# Altium project ws22_companion-1_0_0.PrjPcb (part 3 of 4)

## Sheet eth_lan8742a_phy.SchDoc
size A; SheetNumber: 8
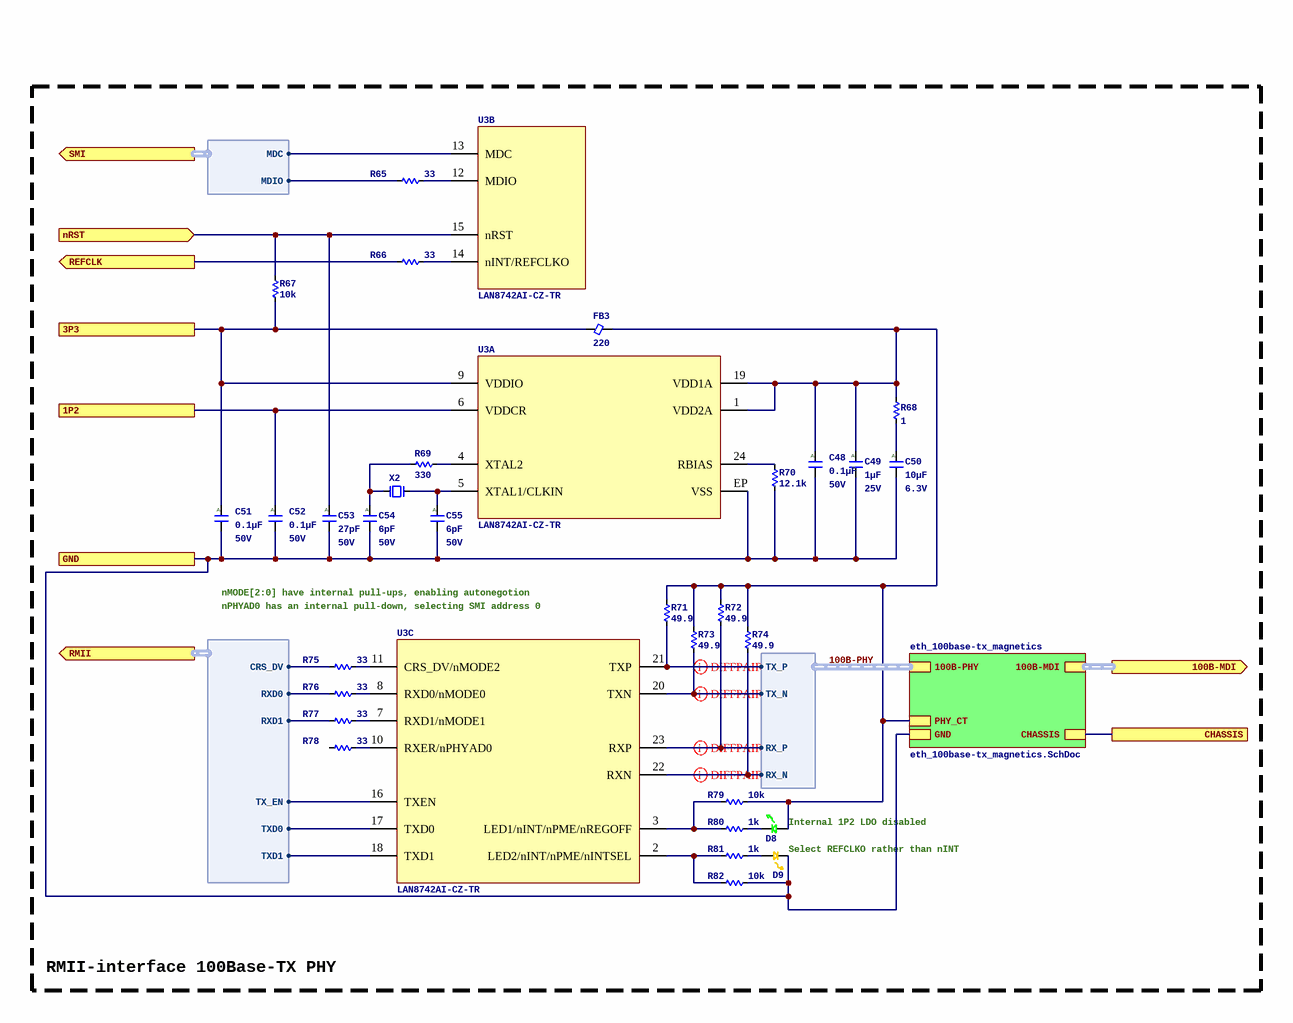
[diagram p9: eth_lan8742a_phy.SchDoc]

### Parts
C48  Capacitance: 0.1µF  Voltage - Rated: 50V  [C0402_0.55MM]  (hidden comment: CGA2B3X7R1H104M050BB)
C49  Capacitance: 1µF  Voltage - Rated: 25V  [C0603_0.80MM]  (hidden comment: CGJ3E1X7R1E105K080AC)
C50  Capacitance: 10µF  Voltage - Rated: 6.3V  [C0805_1.45MM]  (hidden comment: CGA4J1X7R0J106M125AC)
C51  Capacitance: 0.1µF  Voltage - Rated: 50V  [C0402_0.55MM]  (hidden comment: CGA2B3X7R1H104M050BB)
C52  Capacitance: 0.1µF  Voltage - Rated: 50V  [C0402_0.55MM]  (hidden comment: CGA2B3X7R1H104M050BB)
C53  Capacitance: 27pF  Voltage - Rated: 50V  [C0402_0.55MM]  (hidden comment: CGA2B2C0G1H270J050BA)
C54  Capacitance: 6pF  Voltage - Rated: 50V  [C0402_0.55MM]  (hidden comment: CGA2B2C0G1H060D050BA)
C55  Capacitance: 6pF  Voltage - Rated: 50V  [C0402_0.55MM]  (hidden comment: CGA2B2C0G1H060D050BA)
D8  LTST-C190GKT  [LED_0603P_GREEN]  (value not drawn)
D9  LTST-C190AKT  [LED_0603P_AMBER]  (value not drawn)
FB3  Impedance (Ohms @ 100MHz): 220  [FB0402_0.55MM]  (hidden comment: MPZ1005S221ET000)
R65  Resistance: 33  [R0402_0.40MM]  (hidden comment: ERJ-2RKF33R0X)
R66  Resistance: 33  [R0402_0.40MM]  (hidden comment: ERJ-2RKF33R0X)
R67  Resistance: 10k  [R0402_0.40MM]  (hidden comment: ERJ-2RKF1002X)
R68  Resistance: 1  [R0402_0.40MM]  (hidden comment: ERJ-2BQF1R0X)
R69  Resistance: 330  [R0402_0.40MM]  (hidden comment: ERJ-PA2F3300X)
R70  Resistance: 12.1k  [R0402_0.40MM]  (hidden comment: ERJ-2RKF1212X)
R71  Resistance: 49.9  [R0402_0.40MM]  (hidden comment: ERJ-2RKF49R9X)
R72  Resistance: 49.9  [R0402_0.40MM]  (hidden comment: ERJ-2RKF49R9X)
R73  Resistance: 49.9  [R0402_0.40MM]  (hidden comment: ERJ-2RKF49R9X)
R74  Resistance: 49.9  [R0402_0.40MM]  (hidden comment: ERJ-2RKF49R9X)
R75  Resistance: 33  [R0402_0.40MM]  (hidden comment: ERJ-2RKF33R0X)
R76  Resistance: 33  [R0402_0.40MM]  (hidden comment: ERJ-2RKF33R0X)
R77  Resistance: 33  [R0402_0.40MM]  (hidden comment: ERJ-2RKF33R0X)
R78  Resistance: 33  [R0402_0.40MM]  (hidden comment: ERJ-2RKF33R0X)
R79  Resistance: 10k  [R0402_0.40MM]  (hidden comment: ERJ-2RKF1002X)
R80  Resistance: 1k  [R0402_0.40MM]  (hidden comment: ERJ-2RKF1001X)
R81  Resistance: 1k  [R0402_0.40MM]  (hidden comment: ERJ-2RKF1001X)
R82  Resistance: 10k  [R0402_0.40MM]  (hidden comment: ERJ-2RKF1002X)
U3  LAN8742AI-CZ-TR  [24QFN4E]  (parts A,B,C of 3)
X2  XTAL_XRCGB25M000F3A00R0  [4_SMD_2.0X1.6MM]  (value not drawn)

### Sub-sheets
eth_100base-tx_magnetics = eth_100base-tx_magnetics.SchDoc: 100B-PHY (harness 100BASE-TX), GND, CHASSIS, 100B-MDI (harness 100BASE-TX), PHY_CT

### Ports
1P2, 3P3, 100B-MDI (out, harness 100BASE-TX), CHASSIS, GND, nRST (in), REFCLK (out), RMII (out, harness RMII), SMI (out, harness SMI)

### Harnesses
100BASE-TX: RX_N, RX_P, TX_N, TX_P
SMI: MDC, MDIO
RMII: CRS_DV, RXD0, RXD1, TX_EN, TXD0, TXD1

### Nets
1P2: C52.1 U3.6(VDDCR) ; port 1P2
3P3: C51.1 FB3.1 R67.1 U3.9(VDDIO) ; port 3P3
CHASSIS: port CHASSIS, sheet eth_100base-tx_magnetics/CHASSIS
GND: C48.2 C49.2 C50.2 C51.2 C52.2 C53.2 C54.2 C55.2 D9.1 R70.2 R82.2 U3.EP(VSS) ; port GND, sheet eth_100base-tx_magnetics/GND
100B-PHY.RX_N: R74.2 U3.22(RXN) ; sheet eth_100base-tx_magnetics/100B-PHY.RX_N
100B-PHY.RX_P: R72.2 U3.23(RXP) ; sheet eth_100base-tx_magnetics/100B-PHY.RX_P
100B-PHY.TX_N: R73.2 U3.20(TXN) ; sheet eth_100base-tx_magnetics/100B-PHY.TX_N
100B-PHY.TX_P: R71.2 U3.21(TXP) ; sheet eth_100base-tx_magnetics/100B-PHY.TX_P
ETH_PHY_nRST: C53.1 R67.2 U3.15(nRST) ; port nRST
ETH_RMII.CRS_DV: R75.2 ; port RMII.CRS_DV
ETH_RMII.RXD0: R76.2 ; port RMII.RXD0
ETH_RMII.RXD1: R77.2 ; port RMII.RXD1
ETH_RMII.TX_EN: U3.16(TXEN) ; port RMII.TX_EN
ETH_RMII.TXD0: U3.17(TXD0) ; port RMII.TXD0
ETH_RMII.TXD1: U3.18(TXD1) ; port RMII.TXD1
ETH_RMII_REFCLK: R66.2 ; port REFCLK
ETH_SMI.MDC: U3.13(MDC) ; port SMI.MDC
ETH_SMI.MDIO: R65.2 ; port SMI.MDIO
NetC48_1: C48.1 C49.1 D8.2 FB3.2 R68.2 R71.1 R72.1 R73.1 R74.1 R79.2 U3.1(VDD2A) U3.19(VDD1A) ; sheet eth_100base-tx_magnetics/PHY_CT
NetC50_1: C50.1 R68.1
NetC54_1: C54.1 R69.1 X2.3
NetC55_1: C55.1 U3.5(XTAL1/CLKIN) X2.1
NetD8_1: D8.1 R80.1
NetD9_2: D9.2 R81.1
NetR65_1: R65.1 U3.12(MDIO)
NetR66_1: R66.1 U3.14(nINT/REFCLKO)
NetR69_2: R69.2 U3.4(XTAL2)
NetR70_1: R70.1 U3.24(RBIAS)
NetR75_1: R75.1 U3.11(CRS_DV/nMODE2)
NetR76_1: R76.1 U3.8(RXD0/nMODE0)
NetR77_1: R77.1 U3.7(RXD1/nMODE1)
NetR78_1: R78.1 U3.10(RXER/nPHYAD0)
NetR79_1: R79.1 R80.2 U3.3(LED1/nINT/nPME/nREGOFF)
NetR81_2: R81.2 R82.1 U3.2(LED2/nINT/nPME/nINTSEL)

Not connected (* = marked no-connect by the designer): R78 2

### Buses and harness runs
harness 100B-PHY = sheet eth_100base-tx_magnetics/100B-PHY
harness port 100B-MDI = sheet eth_100base-tx_magnetics/100B-MDI

### Layout directives
differential pair; differential pair class DE_100: 100B-PHY.RX_N, 100B-PHY.RX_P, 100B-PHY.TX_N, 100B-PHY.TX_P

### Notes on the sheet
- nMODE[2:0] have internal pull-ups, enabling autonegotion
- nPHYAD0 has an internal pull-down, selecting SMI address 0
- (near D8) Internal 1P2 LDO disabled
- Select REFCLKO rather than nINT
- RMII-interface 100Base-TX PHY
- (in symbol CGA2B2C0G1H060D050BA) A
- (in symbol CGA2B2C0G1H270J050BA) A
- (in symbol CGA2B3X7R1H104M050BB) A
- (in symbol CGA4J1X7R0J106M125AC) A
- (in symbol CGJ3E1X7R1E105K080AC) A

### Library data of the parts
C48 C51 C52 = CGA2B3X7R1H104M050BB: CAP CER 0.1UF 50V X7R 0402; Manufacturer: TDK Corporation; Unit Price (USD): 0.17; Tolerance: ±20%; ComponentLink1URL: https://product.tdk.com/info/en/catalog/datasheets/mlcc_automotive_general_en.pdf?ref_disty=digikey; ComponentLink1Description: Series Datasheet; Series: CGA; Part Status: Active; Temperature Coefficient: X7R; Operating Temperature: -55°C ~ 125°C; Applications: AEC-Q200; Mounting Type: Surface Mount, MLCC; Package / Case: 0402 (1005 Metric); Size / Dimension: 0.039" L x 0.020" W (1.00mm x 0.50mm); Thickness (Max): 0.022" (0.55mm); Supplier 1: Digikey; Supplier Part Number 1: 445-12271-1-ND; Manufacturer Part Number: CGA2B3X7R1H104M050BB
C49 = CGJ3E1X7R1E105K080AC: CAP CER 1UF 25V X7R 0603; Manufacturer: TDK Corporation; Unit Price (USD): 0.55; Tolerance: ±10%; ComponentLink1URL: https://product.tdk.com/info/en/catalog/datasheets/mlcc_highreliability_general_en.pdf?ref_disty=digikey; ComponentLink1Description: Series Datasheet; Series: CGJ; Part Status: Active; Temperature Coefficient: X7R; Operating Temperature: -55°C ~ 125°C; Applications: AEC-Q200; Mounting Type: Surface Mount, MLCC; Package / Case: 0603 (1608 Metric); Size / Dimension: 0.063" L x 0.031" W (1.60mm x 0.80mm); Thickness (Max): 0.031" (0.80mm); Supplier 1: Digikey; Supplier Part Number 1: 445-13311-1-ND; Manufacturer Part Number: CGJ3E1X7R1E105K080AC
C50 = CGA4J1X7R0J106M125AC: CAP CER 10UF 6.3V X7R 0805; Manufacturer: TDK Corporation; Unit Price (USD): 0.43; Tolerance: ±20%; ComponentLink1URL: https://product.tdk.com/info/en/catalog/datasheets/mlcc_automotive_general_en.pdf?ref_disty=digikey; ComponentLink1Description: Series Datasheet; Series: CGA; Part Status: Active; Temperature Coefficient: X7R; Operating Temperature: -55°C ~ 125°C; Applications: AEC-Q200; Mounting Type: Surface Mount, MLCC; Package / Case: 0805 (2012 Metric); Size / Dimension: 0.079" L x 0.049" W (2.00mm x 1.25mm); Thickness (Max): 0.057" (1.45mm); Supplier 1: Digikey; Supplier Part Number 1: 445-12776-1-ND; Manufacturer Part Number: CGA4J1X7R0J106M125AC
C53 = CGA2B2C0G1H270J050BA: CAP CER 27PF 50V C0G 0402; Manufacturer: TDK Corporation; Unit Price (USD): 0.1; Tolerance: ±5%; Temperature Coefficient: C0G, NP0; ComponentLink1URL: https://product.tdk.com/info/en/catalog/datasheets/mlcc_automotive_general_en.pdf?ref_disty=digikey; ComponentLink1Description: Series Datasheet; Supplier 1: Digikey; Supplier Part Number 1: 445-5589-1-ND; Series: CGA; Part Status: Active; Operating Temperature: -55°C ~ 125°C; Applications: AEC-Q200; Mounting Type: Surface Mount, MLCC; Package / Case: 0402 (1005 Metric); Size / Dimension: 0.039" L x 0.020" W (1.00mm x 0.50mm); Thickness (Max): 0.022" (0.55mm); Manufacturer Part Number: CGA2B2C0G1H270J050BA
C54 C55 = CGA2B2C0G1H060D050BA: CAP CER 6PF 50V C0G 0402; Manufacturer: TDK Corporation; Unit Price (USD): 0.1; Tolerance: ±0.5pF; Temperature Coefficient: C0G, NP0; ComponentLink1URL: https://product.tdk.com/info/en/catalog/datasheets/mlcc_automotive_general_en.pdf?ref_disty=digikey; ComponentLink1Description: Series Datasheet; Supplier 1: Digikey; Supplier Part Number 1: 445-5579-1-ND; Series: CGA; Part Status: Active; Operating Temperature: -55°C ~ 125°C; Applications: AEC-Q200; Mounting Type: Surface Mount, MLCC; Package / Case: 0402 (1005 Metric); Size / Dimension: 0.039" L x 0.020" W (1.00mm x 0.50mm); Thickness (Max): 0.022" (0.55mm); Manufacturer Part Number: CGA2B2C0G1H060D050BA
D8 = LED_0603_GREEN_LTST-C190GKT: LED GREEN CLEAR 0603 SMD; Manufacturer: Lite-On Inc; Supplier 1: Digikey; ComponentLink1URL: https://mm.digikey.com/Volume0/opasdata/d220001/medias/docus/858/LTST-C190GKT.pdf; ComponentLink1Description: Datasheet; Supplier Part Number 1: 160-1183-1-ND; Manufacturer Part Number: LTST-C190GKT; Supplier 2: LCSC; Supplier Part Number 2: C125093
D9 = LED_0603_AMBER_LTST-C190AKT: LED AMBER CLEAR 0603 SMD; Manufacturer: Lite-On Inc; Supplier 1: Digikey; ComponentLink1URL: https://mm.digikey.com/Volume0/opasdata/d220001/medias/docus/1139/LTST-C190AKT.pdf; ComponentLink1Description: Datasheet; Supplier Part Number 1: 160-1180-1-ND; Manufacturer Part Number: LTST-C190AKT; Supplier 2: LCSC; Supplier Part Number 2: C6085129
FB3 = MPZ1005S221ET000: FERRITE BEAD 220 OHM 0402 1LN; Manufacturer: TDK Corporation; Filter Type: Power Line; Current Rating (Max): 900mA; DC Resistance (DCR) (Max): 220mOhm; ComponentLink1URL: https://product.tdk.com/info/en/catalog/datasheets/beads_commercial_power_mpz1005-e_en.pdf?ref_disty=digikey; ComponentLink1Description: Datasheet; Series: MPZ-E; Part Status: Active; Operating Temperature: -55°C ~ 125°C; Package / Case: 0402 (1005 Metric); Mounting Type: Surface Mount; Height (Max): 0.022" (0.55mm); Size / Dimension: 0.039" L x 0.020" W (1.00mm x 0.50mm); Supplier Part Number 1: 445-9329-1-ND; Supplier 1: Digikey; Manufacturer Part Number: MPZ1005S221ET000
R65 R66 R75-R78 = ERJ-2RKF33R0X: RES SMD 33 OHM 1% 1/10W 0402; Manufacturer: Panasonic Electronic Components; Unit Price (USD): 0.1; Power (Watts): 0.1W, 1/10W; Temperature Coefficient: ±100ppm/°C; ComponentLink1Description: Datasheet; ComponentLink1URL: https://industrial.panasonic.com/cdbs/www-data/pdf/RDA0000/AOA0000C304.pdf; Series: ERJ; Tolerance: ±1%; Composition: Thick Film; Features: Automotive AEC-Q200; Operating Temperature: -55°C ~ 155°C; Package / Case: 0402 (1005 Metric); Supplier Device Package: 0402; Size / Dimension: 0.039" L x 0.020" W (1.00mm x 0.50mm); Height - Seated (Max): 0.016" (0.40mm); Supplier 1: Digikey; Supplier Part Number 1: P33.0LCT-ND; Manufacturer Part Number: ERJ-2RKF33R0X
R67 R79 R82 = ERJ-2RKF1002X: RES SMD 10K OHM 1% 1/10W 0402; Manufacturer: Panasonic Electronic Components; Unit Price (USD): 0.1; Power (Watts): 0.1W, 1/10W; Temperature Coefficient: ±100ppm/°C; ComponentLink1Description: Datasheet; ComponentLink1URL: https://industrial.panasonic.com/cdbs/www-data/pdf/RDA0000/AOA0000C304.pdf; Series: ERJ; Tolerance: ±1%; Composition: Thick Film; Features: Automotive AEC-Q200; Operating Temperature: -55°C ~ 155°C; Package / Case: 0402 (1005 Metric); Supplier Device Package: 0402; Size / Dimension: 0.039" L x 0.020" W (1.00mm x 0.50mm); Height - Seated (Max): 0.016" (0.40mm); Supplier 1: Digikey; Supplier Part Number 1: P10.0KLCT-ND; Manufacturer Part Number: ERJ-2RKF1002X
R68 = ERJ-2BQF1R0X: RES SMD 1 OHM 1% 1/6W 0402; Manufacturer: Panasonic Electronic Components; Unit Price (USD): 0.41; Power (Watts): 0.167W, 1/6W; Temperature Coefficient: ±250ppm/°C; ComponentLink1Description: Datasheet; ComponentLink1URL: https://industrial.panasonic.com/cdbs/www-data/pdf/RDN0000/AOA0000C313.pdf; Series: ERJ; Tolerance: ±1%; Composition: Thick Film; Features: Automotive AEC-Q200, Current Sense; Operating Temperature: -55°C ~ 125°C; Package / Case: 0402 (1005 Metric); Supplier Device Package: 0402; Size / Dimension: 0.039" L x 0.020" W (1.00mm x 0.50mm); Height - Seated (Max): 0.016" (0.40mm); Supplier 1: Digikey; Supplier Part Number 1: P17252CT-ND; Manufacturer Part Number: ERJ-2BQF1R0X
R69 = ERJ-PA2F3300X: RES SMD 330 OHM 1% 1/5W 0402; Manufacturer: Panasonic Electronic Components; Unit Price (USD): 0.21; Power (Watts): 0.2W, 1/5W; Temperature Coefficient: ±100ppm/°C; ComponentLink1Description: Datasheet; ComponentLink1URL: https://industrial.panasonic.com/cdbs/www-data/pdf/RDO0000/AOA0000C331.pdf; Series: ERJ; Tolerance: ±1%; Composition: Thick Film; Features: Automotive AEC-Q200, Pulse Withstanding; Operating Temperature: -55°C ~ 155°C; Package / Case: 0402 (1005 Metric); Supplier Device Package: 0402; Size / Dimension: 0.039" L x 0.020" W (1.00mm x 0.50mm); Height - Seated (Max): 0.016" (0.40mm); Supplier 1: Digikey; Supplier Part Number 1: P17221CT-ND; Manufacturer Part Number: ERJ-PA2F3300X
R70 = ERJ-2RKF1212X: RES SMD 12.1K OHM 1% 1/10W 0402; Manufacturer: Panasonic Electronic Components; Unit Price (USD): 0.1; Power (Watts): 0.1W, 1/10W; Temperature Coefficient: ±100ppm/°C; ComponentLink1Description: Datasheet; ComponentLink1URL: https://industrial.panasonic.com/cdbs/www-data/pdf/RDA0000/AOA0000C304.pdf; Series: ERJ; Tolerance: ±1%; Composition: Thick Film; Features: Automotive AEC-Q200; Operating Temperature: -55°C ~ 155°C; Package / Case: 0402 (1005 Metric); Supplier Device Package: 0402; Size / Dimension: 0.039" L x 0.020" W (1.00mm x 0.50mm); Height - Seated (Max): 0.016" (0.40mm); Supplier 1: Digikey; Supplier Part Number 1: P12.1KLCT-ND; Manufacturer Part Number: ERJ-2RKF1212X
R71-R74 = ERJ-2RKF49R9X: RES SMD 49.9 OHM 1% 1/10W 0402; Manufacturer: Panasonic Electronic Components; Unit Price (USD): 0.1; Power (Watts): 0.1W, 1/10W; Temperature Coefficient: ±100ppm/°C; ComponentLink1Description: Datasheet; ComponentLink1URL: https://industrial.panasonic.com/cdbs/www-data/pdf/RDA0000/AOA0000C304.pdf; Series: ERJ; Tolerance: ±1%; Composition: Thick Film; Features: Automotive AEC-Q200; Operating Temperature: -55°C ~ 155°C; Package / Case: 0402 (1005 Metric); Supplier Device Package: 0402; Size / Dimension: 0.039" L x 0.020" W (1.00mm x 0.50mm); Height - Seated (Max): 0.016" (0.40mm); Supplier 1: Digikey; Supplier Part Number 1: P49.9LCT-ND; Manufacturer Part Number: ERJ-2RKF49R9X
R80 R81 = ERJ-2RKF1001X: RES SMD 1K OHM 1% 1/10W 0402; Manufacturer: Panasonic Electronic Components; Unit Price (USD): 0.1; Power (Watts): 0.1W, 1/10W; Temperature Coefficient: ±100ppm/°C; ComponentLink1Description: Datasheet; ComponentLink1URL: https://industrial.panasonic.com/cdbs/www-data/pdf/RDA0000/AOA0000C304.pdf; Series: ERJ; Tolerance: ±1%; Composition: Thick Film; Features: Automotive AEC-Q200; Operating Temperature: -55°C ~ 155°C; Package / Case: 0402 (1005 Metric); Supplier Device Package: 0402; Size / Dimension: 0.039" L x 0.020" W (1.00mm x 0.50mm); Height - Seated (Max): 0.016" (0.40mm); Supplier 1: Digikey; Supplier Part Number 1: P1.00KLCT-ND; Manufacturer Part Number: ERJ-2RKF1001X
U3 = ETH_PHY_LAN8742AI: Ethernet Transceiver, PQCC24; Manufacturer: Microchip; Supplier 1: Digikey; Supplier Part Number 1: LAN8742AI-CZ-CT-ND; Manufacturer Part Number: LAN8742AI-CZ-TR; ComponentLink1URL: https://ww1.microchip.com/downloads/aemDocuments/documents/OTH/ProductDocuments/DataSheets/8742a.pdf; ComponentLink1Description: Datasheet; Supplier 2: LCSC; Supplier Part Number 2: C153279
X2 = XTAL_XRCGB25M000F3A00R0: CRYSTAL 25.000MHZ 6PF SMD; Manufacturer: Murata; Supplier 1: Digikey; Supplier Part Number 1: 490-12146-2-ND; Manufacturer Part Number: XRCGB25M000F3A00R0; ComponentLink1Description: Datasheet; ComponentLink1URL: https://www.murata.com/products/productdata/8801076543518/SPEC-XRCGB25M000F3A00R0.pdf; Supplier 2: LCSC; Supplier Part Number 2: C467842

## Sheet eth_100base-tx_magnetics.SchDoc
size A; SheetNumber: 9
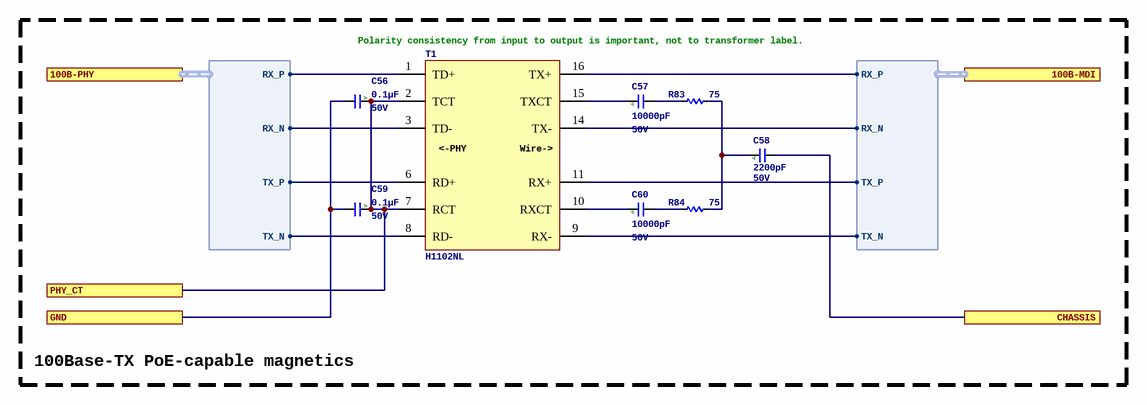
[diagram p10: eth_100base-tx_magnetics.SchDoc]

### Parts
C56  Capacitance: 0.1µF  Voltage - Rated: 50V  [C0402_0.55MM]  (hidden comment: CGA2B3X7R1H104M050BB)
C57  Capacitance: 10000pF  Voltage - Rated: 50V  [C0402_0.50MM]  (hidden comment: CGJ2B3X7R1H103K050BB)
C58  Capacitance: 2200pF  Voltage - Rated: 50V  [C0402_0.55MM]  (hidden comment: CGA2B2X7R1H222M050BA)
C59  Capacitance: 0.1µF  Voltage - Rated: 50V  [C0402_0.55MM]  (hidden comment: CGA2B3X7R1H104M050BB)
C60  Capacitance: 10000pF  Voltage - Rated: 50V  [C0402_0.50MM]  (hidden comment: CGJ2B3X7R1H103K050BB)
R83  Resistance: 75  [R0402_0.40MM]  (hidden comment: ERJ-2RKF75R0X)
R84  Resistance: 75  [R0402_0.40MM]  (hidden comment: ERJ-2RKF75R0X)
T1  H1102NL  [EPCOS_LAN_MODULE]

### Blocks framed on the sheet
100Base-TX PoE-capable magnetics: C56-C60 R83 R84 T1

### Ports
100B-MDI (harness 100BASE-TX), 100B-PHY (harness 100BASE-TX), CHASSIS, GND, PHY_CT

### Harnesses
100BASE-TX: RX_N, RX_P, TX_N, TX_P
100BASE-TX: TX_N, TX_P, RX_N, RX_P

### Nets
CHASSIS: C58.2 ; port CHASSIS
GND: C56.2 C59.2 ; port GND
100B-PHY.RX_N: T1.3(TD-) ; port 100B-PHY.RX_N
100B-PHY.RX_P: T1.1(TD+) ; port 100B-PHY.RX_P
100B-PHY.TX_N: T1.8(RD-) ; port 100B-PHY.TX_N
100B-PHY.TX_P: T1.6(RD+) ; port 100B-PHY.TX_P
ETH_MDI.RX_N: T1.14(TX-) ; port 100B-MDI.RX_N
ETH_MDI.RX_P: T1.16(TX+) ; port 100B-MDI.RX_P
ETH_MDI.TX_N: T1.9(RX-) ; port 100B-MDI.TX_N
ETH_MDI.TX_P: T1.11(RX+) ; port 100B-MDI.TX_P
NetC48_1: C56.1 C59.1 T1.2(TCT) T1.7(RCT) ; port PHY_CT
NetC57_1: C57.1 T1.15(TXCT)
NetC57_2: C57.2 R83.2
NetC58_1: C58.1 R83.1 R84.1
NetC60_1: C60.1 T1.10(RXCT)
NetC60_2: C60.2 R84.2

### Notes on the sheet
- (near T1) Polarity consistency from input to output is important, not to transformer label.
- (in symbol CGA2B2X7R1H222M050BA) A
- (in symbol CGA2B3X7R1H104M050BB) A
- (in symbol CGJ2B3X7R1H103K050BB) A
- (in symbol ETH_H1102NL) <-PHY; Wire->

### Library data of the parts
C56 C59 = CGA2B3X7R1H104M050BB: as C48 on sheet eth_lan8742a_phy; ComponentLink1URL: https://product.tdk.com/info/en/catalog/datasheets/mlcc_automotive_general_en.pdf?ref_disty=digikey; ComponentLink1Description: Series Datasheet; Series: CGA; Part Status: Active; Temperature Coefficient: X7R; Operating Temperature: -55°C ~ 125°C; Applications: AEC-Q200; Mounting Type: Surface Mount, MLCC; Package / Case: 0402 (1005 Metric); Size / Dimension: 0.039" L x 0.020" W (1.00mm x 0.50mm); Thickness (Max): 0.022" (0.55mm); Supplier 1: Digikey; Supplier Part Number 1: 445-12271-1-ND; Manufacturer Part Number: CGA2B3X7R1H104M050BB
C57 C60 = CGJ2B3X7R1H103K050BB: CAP CER 10000PF 50V X7R 0402; Manufacturer: TDK Corporation; Unit Price (USD): 0.21; Tolerance: ±10%; ComponentLink1URL: https://product.tdk.com/info/en/catalog/datasheets/mlcc_highreliability_general_en.pdf?ref_disty=digikey; ComponentLink1Description: Series Datasheet; Series: CGJ; Part Status: Active; Temperature Coefficient: X7R; Operating Temperature: -55°C ~ 125°C; Applications: AEC-Q200; Mounting Type: Surface Mount, MLCC; Package / Case: 0402 (1005 Metric); Size / Dimension: 0.039" L x 0.020" W (1.00mm x 0.50mm); Thickness (Max): 0.020" (0.50mm); Supplier 1: Digikey; Supplier Part Number 1: 445-13304-1-ND; Manufacturer Part Number: CGJ2B3X7R1H103K050BB
C58 = CGA2B2X7R1H222M050BA: CAP CER 2200PF 50V X7R 0402; Manufacturer: TDK Corporation; Unit Price (USD): 0.1; Tolerance: ±20%; ComponentLink1URL: https://product.tdk.com/info/en/catalog/datasheets/mlcc_automotive_general_en.pdf?ref_disty=digikey; ComponentLink1Description: Series Datasheet; Supplier 1: Digikey; Supplier Part Number 1: 445-12274-1-ND; Series: CGA; Part Status: Active; Temperature Coefficient: X7R; Operating Temperature: -55°C ~ 125°C; Applications: AEC-Q200; Mounting Type: Surface Mount, MLCC; Package / Case: 0402 (1005 Metric); Size / Dimension: 0.039" L x 0.020" W (1.00mm x 0.50mm); Thickness (Max): 0.022" (0.55mm); Manufacturer Part Number: CGA2B2X7R1H222M050BA
R83 R84 = ERJ-2RKF75R0X: RES SMD 75 OHM 1% 1/10W 0402; Manufacturer: Panasonic Electronic Components; Unit Price (USD): 0.1; Power (Watts): 0.1W, 1/10W; Temperature Coefficient: ±100ppm/°C; ComponentLink1Description: Datasheet; ComponentLink1URL: https://industrial.panasonic.com/cdbs/www-data/pdf/RDA0000/AOA0000C304.pdf; Series: ERJ; Tolerance: ±1%; Composition: Thick Film; Features: Automotive AEC-Q200; Operating Temperature: -55°C ~ 155°C; Package / Case: 0402 (1005 Metric); Supplier Device Package: 0402; Size / Dimension: 0.039" L x 0.020" W (1.00mm x 0.50mm); Height - Seated (Max): 0.016" (0.40mm); Supplier 1: Digikey; Supplier Part Number 1: P75.0LCT-ND; Manufacturer Part Number: ERJ-2RKF75R0X
T1 = ETH_H1102NL: MODULE XFRMR SGL ETHR LAN 16SOIC; Manufacturer: Pulse Electronics Corporation; Supplier 1: Digikey; ComponentLink1URL: https://productfinder.pulseelectronics.com/api/open/part-attachments/datasheet/H1102NL; ComponentLink1Description: Datasheet; Supplier Part Number 1: 553-1323-ND; Manufacturer Part Number: H1102NL; Supplier 2: LCSC; Supplier Part Number 2: C18584

## Sheet conn_ffc_ws22_8pin.SchDoc
size A; SheetNumber: 6
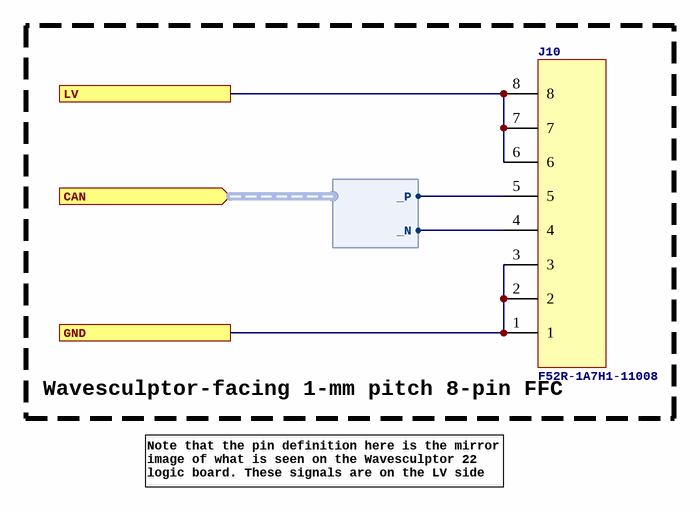
[diagram p11: conn_ffc_ws22_8pin.SchDoc]

### Parts
J10  F52R-1A7H1-11008  [AMPHENOL_F52R-1A7H1-11008]

### Blocks framed on the sheet
Wavesculptor-facing 1-mm pitch 8-pin FFC: J10

### Ports
CAN (in, harness DIFF), GND, LV

### Harnesses
DIFF: _P, _N

### Nets
GND: J10.1 J10.2 J10.3 ; port GND
CAN1_MDI._N: J10.4 ; port CAN._N
CAN1_MDI._P: J10.5 ; port CAN._P
WS22_PWR: J10.6 J10.7 J10.8 ; port LV

### Notes on the sheet
- Note that the pin definition here is the mirror image of what is seen on the Wavesculptor 22 logic board. These signals are on the LV side of the Wavesculptor 22.

### Library data of the parts
J10 = CONN_AMPHENOL_FPC_F52R-1A7H1-11008: Conn, R/a, Ffc/fpc, 8POS, 1ROW, 1MM Rohs Compliant: Yes; Manufacturer: Amphenol Communications Solutions; Supplier 1: Digikey; Supplier Part Number 1: 609-F52R-1A7H1-11008CT-ND; Manufacturer Part Number: F52R-1A7H1-11008; Supplier 2: LCSC; Supplier Part Number 2: C3168998

## Sheet conn_ffc_ws22_12pin.SchDoc
size A; SheetNumber: 5
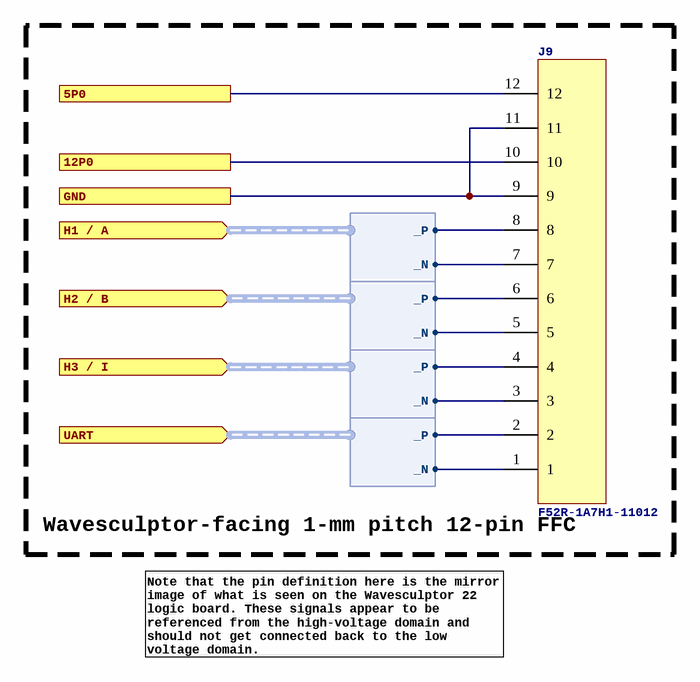
[diagram p12: conn_ffc_ws22_12pin.SchDoc]

### Parts
J9  F52R-1A7H1-11012  [AMPHENOL_F52R-1A7H1-11012]

### Blocks framed on the sheet
Wavesculptor-facing 1-mm pitch 12-pin FFC: J9

### Ports
5P0, 12P0, GND, H1 / A (in, harness DIFF), H2 / B (in, harness DIFF), H3 / I (in, harness DIFF), UART (in, harness DIFF)

### Harnesses
DIFF: _P, _N

### Nets
5P0_B: J9.12 ; port 5P0
12P0_B: J9.10 ; port 12P0
GND_B: J9.9 J9.11 ; port GND
WS22_A._N: J9.7 ; port H1 / A._N
WS22_A._P: J9.8 ; port H1 / A._P
WS22_B._N: J9.5 ; port H2 / B._N
WS22_B._P: J9.6 ; port H2 / B._P
WS22_I._N: J9.3 ; port H3 / I._N
WS22_I._P: J9.4 ; port H3 / I._P
WS22_UART._N: J9.1 ; port UART._N
WS22_UART._P: J9.2 ; port UART._P

### Notes on the sheet
- Note that the pin definition here is the mirror image of what is seen on the Wavesculptor 22 logic board. These signals appear to be referenced from the high-voltage domain and should not get connected back to the low voltage domain.

### Library data of the parts
J9 = CONN_AMPHENOL_FPC_F52R-1A7H1-11012: FPC/FFC Connector Socket 12 Position 1mm Bottom Contact Solder Right Angle Surface Mount T/R; Manufacturer: Amphenol ICC / FCI; Supplier 1: Digikey; Supplier Part Number 1: 609-F52R-1A7H1-11012CT-ND; Manufacturer Part Number: F52R-1A7H1-11012; Supplier 2: LCSC; Supplier Part Number 2: C3169442

## Sheet conn_lv.SchDoc
size A; SheetNumber: 4
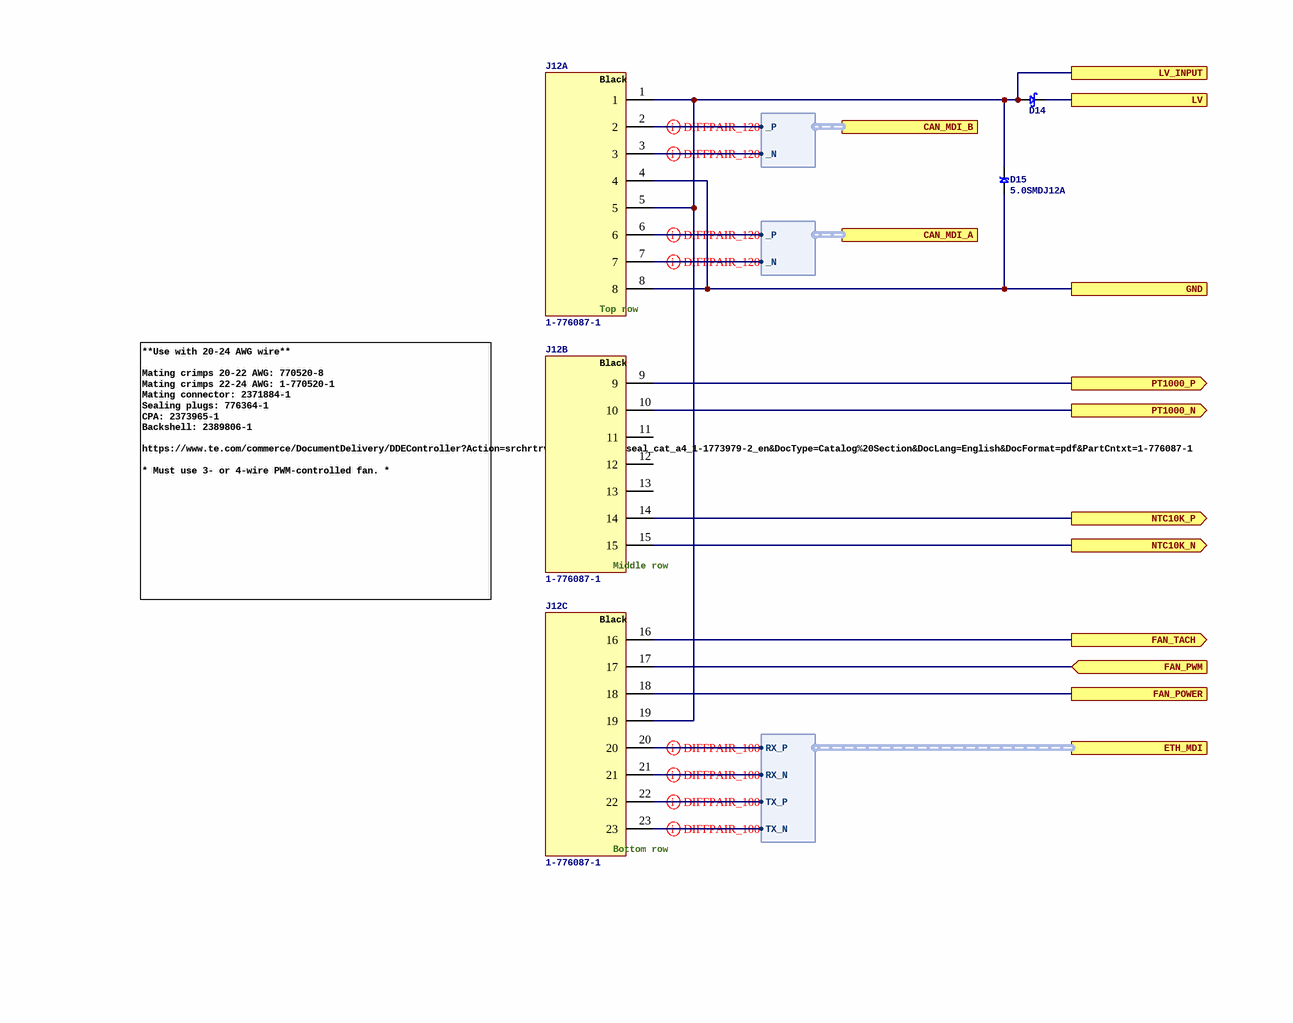
[diagram p13: conn_lv.SchDoc]

### Parts
D14  B340A-13-F  [SMA]  (value not drawn)
D15  5.0SMDJ12A  [SMC]
J12  1-776087-1  [TE_AMPSEAL_1-776087-1]  (parts A,B,C of 3)

### Ports
CAN_MDI_A (harness DIFF), CAN_MDI_B (harness DIFF), ETH_MDI (harness 100BASE-TX), FAN_POWER, FAN_PWM (in), FAN_TACH (out), GND, LV, LV_INPUT, NTC10K_N (out), NTC10K_P (out), PT1000_N (out), PT1000_P (out)

### Harnesses
DIFF: _P, _N
100BASE-TX: TX_N, TX_P, RX_N, RX_P

### Nets
GND: D15.1 J12.4 J12.8 ; port GND
LV: D14.2 ; port LV
LV_INPUT: D14.1 D15.2 J12.1 J12.5 J12.19 ; port LV_INPUT
AMBIENT_NTC10K_N: J12.15 ; port NTC10K_N
AMBIENT_NTC10K_P: J12.14 ; port NTC10K_P
AMBIENT_PT1000_N: J12.9 ; port PT1000_P
AMBIENT_PT1000_P: J12.10 ; port PT1000_N
CAN1_MDI._N: J12.3 J12.7 ; port CAN_MDI_A._N
CAN1_MDI._P: J12.2 J12.6 ; port CAN_MDI_A._P
ETH_MDI.RX_N: J12.21 ; port ETH_MDI.RX_N
ETH_MDI.RX_P: J12.20 ; port ETH_MDI.RX_P
ETH_MDI.TX_N: J12.23 ; port ETH_MDI.TX_N
ETH_MDI.TX_P: J12.22 ; port ETH_MDI.TX_P
FAN0_POWER: J12.18 ; port FAN_POWER
FAN0_PWM: J12.17 ; port FAN_PWM
FAN0_TACH: J12.16 ; port FAN_TACH

Not connected (* = marked no-connect by the designer): J12 11 12 13

### Layout directives
differential pair; differential pair class DE_100: CAN1_MDI._N, CAN1_MDI._P, ETH_MDI.RX_N, ETH_MDI.RX_P, ETH_MDI.TX_N, ETH_MDI.TX_P

### Notes on the sheet
- **Use with 20-24 AWG wire**
  Mating crimps 20-22 AWG: 770520-8
  Mating crimps 22-24 AWG: 1-770520-1
  Mating connector: 2371884-1
  Sealing plugs: 776364-1
  CPA: 2373965-1
  Backshell: 2389806-1
  https://www.te.com/commerce/DocumentDelivery/DDEController?Action=srchrtrv&DocNm=ict_ampseal_cat_a4_1-1773979-2_en&DocType=Catalog%20Section&DocLang=English&DocFormat=pdf&PartCntxt=1-776087-1
  * Must use 3- or 4-wire PWM-controlled fan. *
- (in symbol CONN_AMPSEAL_23POS_RA_1-776087-1, part A) Black; Top row
- (in symbol CONN_AMPSEAL_23POS_RA_1-776087-1, part B) Black; Middle row
- (in symbol CONN_AMPSEAL_23POS_RA_1-776087-1, part C) Black; Bottom row

### Library data of the parts
D14 = SCHOTTKY_B340A-13-F: Rectifier Diode, Schottky, 1 Phase, 1 Element, 3A, 40V V(RRM), Silicon; Manufacturer: Diodes; Supplier 1: Digikey; ComponentLink1URL: https://www.diodes.com/assets/Datasheets/ds30891.pdf; Supplier Part Number 1: B340A-FDICT-ND; ComponentLink1Description: Datasheet; Manufacturer Part Number: B340A-13-F; Supplier 2: LCSC; Supplier Part Number 2: C85098
D15 = TVS_UNI_5.0SMDJ12A: TVS 5000W 12V UNIDIRECT SMCJ; Manufacturer: Littelfuse; ComponentLink1URL: https://www.littelfuse.com/media?resourcetype=datasheets&itemid=2b2f4a8c-2e81-4894-8d41-3d748bb79e68&filename=littelfuse-tvs-diode-5-0smdj-datasheet; ComponentLink1Description: Datasheet; Supplier 1: Digikey; Supplier Part Number 1: 5.0SMDJ12ACT-ND; Manufacturer Part Number: 5.0SMDJ12A; Supplier 2: LCSC; Supplier Part Number 2: C126819
J12 = CONN_AMPSEAL_23POS_RA_1-776087-1: Conn Power PL 23 POS 4mm Solder RA Thru-Hole 23 Terminal 1 Port, BLACK; Manufacturer: TE Connectivity; Supplier 1: Digikey; Supplier Part Number 1: 1734-1-776087-1-ND; Manufacturer Part Number: 1-776087-1; ComponentLink1Description: Product page; ComponentLink1URL: https://www.te.com/en/product-1-776087-1.html; ComponentLink2Description: Drawing; ComponentLink2URL: https://www.te.com/commerce/DocumentDelivery/DDEController?Action=srchrtrv&DocNm=776087&DocType=Customer%20Drawing&DocLang=English&DocFormat=pdf&PartCntxt=1-776087-1; ComponentLink3Description: Application specification; ComponentLink3URL: https://www.te.com/commerce/DocumentDelivery/DDEController?Action=srchrtrv&DocNm=114-16016&DocType=Specification%20Or%20Standard&DocLang=English&DocFormat=pdf&PartCntxt=1-776087-1; Supplier 2: LCSC; Supplier Part Number 2: C590311; ComponentLink4Description: Series catalog; ComponentLink4URL: https://www.te.com/commerce/DocumentDelivery/DDEController?Action=srchrtrv&DocNm=1-1773979-2&DocType=Data%20Sheet&DocLang=English&DocFormat=pdf&PartCntxt=1-776087-1; ComponentLink5Description: Product specification; ComponentLink5URL: https://www.te.com/commerce/DocumentDelivery/DDEController?Action=srchrtrv&DocNm=108-1329&DocType=Specification%20Or%20Standard&DocLang=English&DocFormat=pdf&PartCntxt=1-776087-1

## Sheet conn_motor.SchDoc
size A; SheetNumber: 3
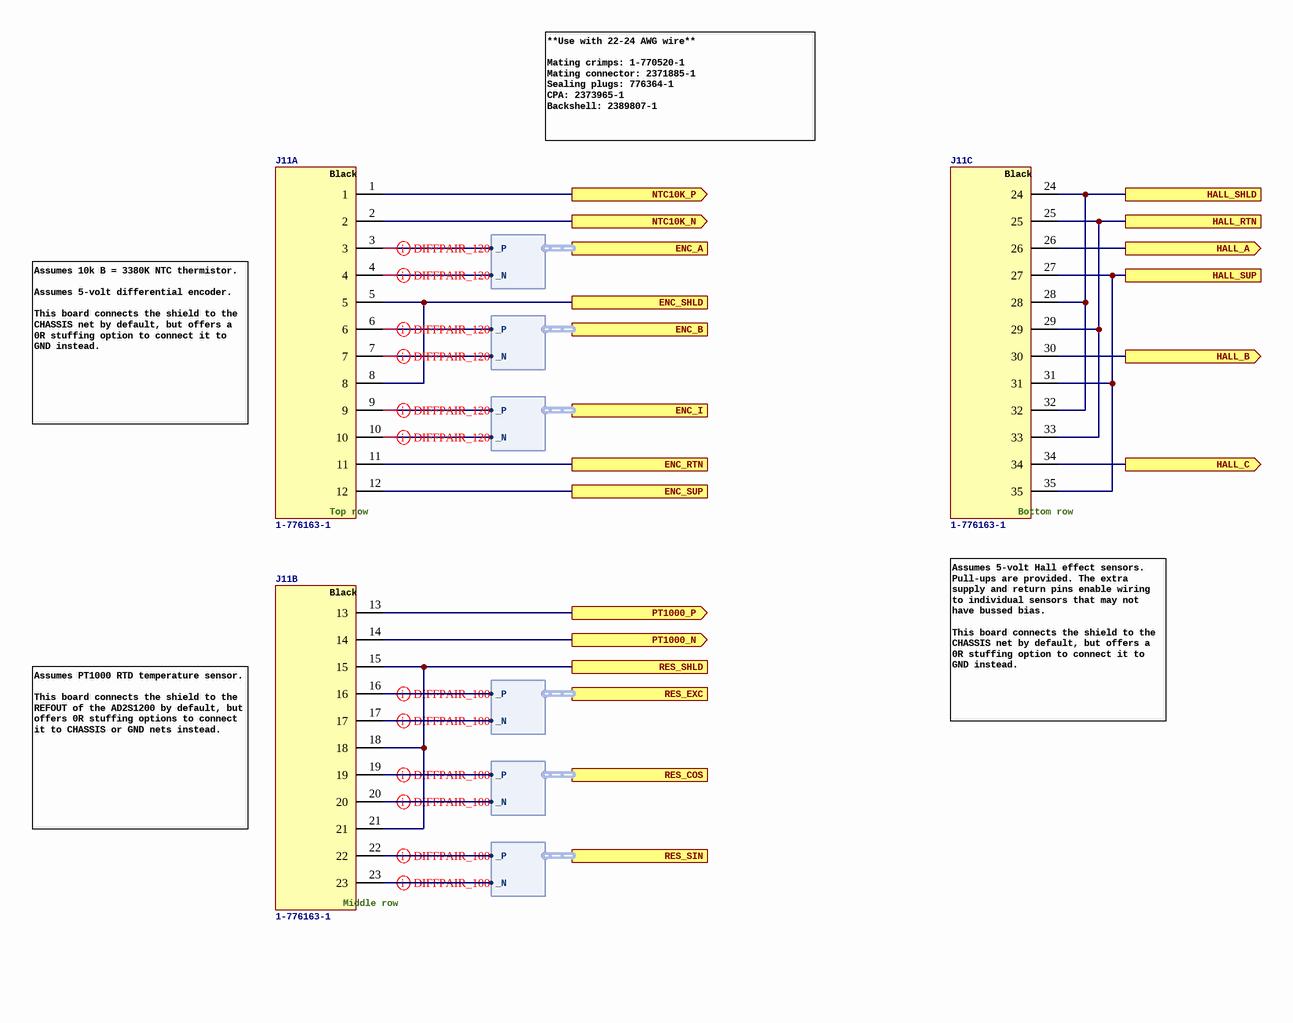
[diagram p14: conn_motor.SchDoc]

### Parts
J11  1-776163-1  [TE_AMPSEAL_1-776163-1]  (parts A,B,C of 3)

### Ports
ENC_A (harness DIFF), ENC_B (harness DIFF), ENC_I (harness DIFF), ENC_RTN, ENC_SHLD, ENC_SUP, HALL_A (out), HALL_B (out), HALL_C (out), HALL_RTN, HALL_SHLD, HALL_SUP, NTC10K_N (out), NTC10K_P (out), PT1000_N (out), PT1000_P (out), RES_COS (harness DIFF), RES_EXC (harness DIFF), RES_SHLD, RES_SIN (harness DIFF)

### Harnesses
DIFF: _P, _N

### Nets
5P0: J11.12 ; port ENC_SUP
GND: J11.11 J11.25 J11.29 J11.33 ; port ENC_RTN, port HALL_RTN
CONN_ENC_A._N: J11.4 ; port ENC_A._N
CONN_ENC_A._P: J11.3 ; port ENC_A._P
CONN_ENC_B._N: J11.7 ; port ENC_B._N
CONN_ENC_B._P: J11.6 ; port ENC_B._P
CONN_ENC_I._N: J11.10 ; port ENC_I._N
CONN_ENC_I._P: J11.9 ; port ENC_I._P
CONN_HALL_A: J11.26 ; port HALL_A
CONN_HALL_B: J11.30 ; port HALL_B
CONN_HALL_C: J11.34 ; port HALL_C
CONN_HALL_SUPPLY: J11.27 J11.31 J11.35 ; port HALL_SUP
CONN_RES_COS._N: J11.20 ; port RES_COS._N
CONN_RES_COS._P: J11.19 ; port RES_COS._P
CONN_RES_EXC._N: J11.17 ; port RES_EXC._N
CONN_RES_EXC._P: J11.16 ; port RES_EXC._P
CONN_RES_SIN._N: J11.23 ; port RES_SIN._N
CONN_RES_SIN._P: J11.22 ; port RES_SIN._P
ENC_SHIELD: J11.5 J11.8 ; port ENC_SHLD
HALL_SHIELD: J11.24 J11.28 J11.32 ; port HALL_SHLD
MOTOR_NTC10K_N: J11.2 ; port NTC10K_N
MOTOR_NTC10K_P: J11.1 ; port NTC10K_P
MOTOR_PT1000_N: J11.14 ; port PT1000_N
MOTOR_PT1000_P: J11.13 ; port PT1000_P
RES_SHIELD: J11.15 J11.18 J11.21 ; port RES_SHLD

### Layout directives
differential pair; differential pair class DE_100: CONN_ENC_A._N, CONN_ENC_A._P, CONN_ENC_B._N, CONN_ENC_B._P, CONN_ENC_I._N, CONN_ENC_I._P, CONN_RES_COS._N, CONN_RES_COS._P, CONN_RES_EXC._N, CONN_RES_EXC._P, CONN_RES_SIN._N, CONN_RES_SIN._P

### Notes on the sheet
- **Use with 22-24 AWG wire**
  Mating crimps: 1-770520-1
  Mating connector: 2371885-1
  Sealing plugs: 776364-1
  CPA: 2373965-1
  Backshell: 2389807-1
- Assumes 10k B = 3380K NTC thermistor.
  Assumes 5-volt differential encoder.
  This board connects the shield to the CHASSIS net by default, but offers a 0R stuffing option to connect it to GND instead.
- Assumes 5-volt Hall effect sensors. Pull-ups are provided. The extra supply and return pins enable wiring to individual sensors that may not have bussed bias.
  This board connects the shield to the CHASSIS net by default, but offers a 0R stuffing option to connect it to GND instead.
- Assumes PT1000 RTD temperature sensor.
  This board connects the shield to the REFOUT of the AD2S1200 by default, but offers 0R stuffing options to connect it to CHASSIS or GND nets instead.
- (in symbol CONN_AMPSEAL_35POS_RA_1-776163-1, part A) Black; Top row
- (in symbol CONN_AMPSEAL_35POS_RA_1-776163-1, part B) Black; Middle row
- (in symbol CONN_AMPSEAL_35POS_RA_1-776163-1, part C) Black; Bottom row

### Library data of the parts
J11 = CONN_AMPSEAL_35POS_RA_1-776163-1: Conn Power PL 35 POS 4mm Solder RA Thru-Hole 35 Terminal 1 Port, BLACK; Manufacturer: TE Connectivity; Supplier 1: Digikey; Supplier Part Number 1: A106383-ND; Manufacturer Part Number: 1-776163-1; ComponentLink1Description: Product page; ComponentLink1URL: https://www.te.com/en/product-1-776163-1.html; ComponentLink2Description: Drawing; ComponentLink2URL: https://www.te.com/commerce/DocumentDelivery/DDEController?Action=showdoc&DocId=Customer+Drawing%7F776163%7FK%7Fpdf%7FEnglish%7FENG_CD_776163_K.pdf%7F1-776163-1; ComponentLink3Description: Application specification; ComponentLink3URL: https://www.te.com/commerce/DocumentDelivery/DDEController?Action=showdoc&DocId=Specification+Or+Standard%7F114-16016%7FR1%7Fpdf%7FEnglish%7FENG_SS_114-16016_R1.pdf%7F1-776163-1; Supplier 2: LCSC; Supplier Part Number 2: C596198; ComponentLink4Description: Series catalog; ComponentLink4URL: https://www.te.com/commerce/DocumentDelivery/DDEController?Action=showdoc&DocId=Data+Sheet%7F1-1773979-2%7FA%7Fpdf%7FEnglish%7FENG_DS_1-1773979-2_A.pdf%7F1-776280-1; ComponentLink5Description: Product specification; ComponentLink5URL: https://www.te.com/commerce/DocumentDelivery/DDEController?Action=showdoc&DocId=Specification+Or+Standard%7F108-1329%7FE1%7Fpdf%7FEnglish%7FENG_SS_108-1329_E1.pdf%7F1-776163-1

## Sheet driver_am26c31_isolated.SchDoc
size A; SheetNumber: 14
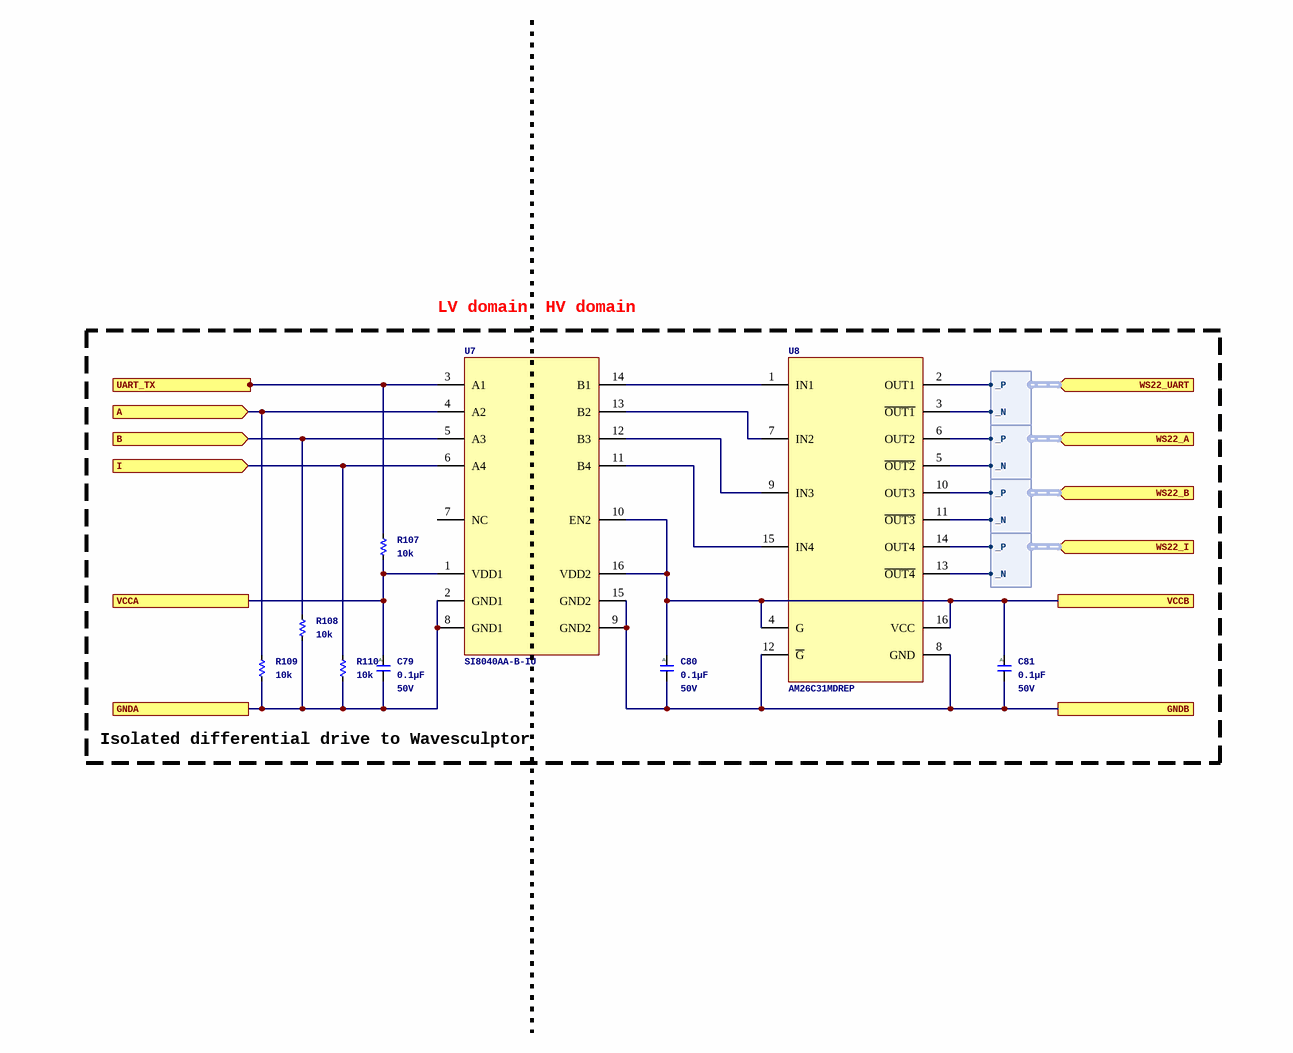
[diagram p15: driver_am26c31_isolated.SchDoc]

### Parts
C79  Capacitance: 0.1µF  Voltage - Rated: 50V  [C0402_0.55MM]  (hidden comment: CGA2B3X7R1H104M050BB)
C80  Capacitance: 0.1µF  Voltage - Rated: 50V  [C0402_0.55MM]  (hidden comment: CGA2B3X7R1H104M050BB)
C81  Capacitance: 0.1µF  Voltage - Rated: 50V  [C0402_0.55MM]  (hidden comment: CGA2B3X7R1H104M050BB)
R107  Resistance: 10k  [R0402_0.40MM]  (hidden comment: ERJ-2RKF1002X)
R108  Resistance: 10k  [R0402_0.40MM]  (hidden comment: ERJ-2RKF1002X)
R109  Resistance: 10k  [R0402_0.40MM]  (hidden comment: ERJ-2RKF1002X)
R110  Resistance: 10k  [R0402_0.40MM]  (hidden comment: ERJ-2RKF1002X)
U7  SI8040AA-B-IU  [16SSOP635]
U8  AM26C31MDREP  [16SOIC150]

### Ports
A (in), B (in), GNDA, GNDB, I (in), UART_TX (in), VCCA, VCCB, WS22_A (in, harness DIFF), WS22_B (in, harness DIFF), WS22_I (in, harness DIFF), WS22_UART (in, harness DIFF)

### Harnesses
DIFF: _P, _N

### Nets
3P3: C79.1 R107.1 U7.1(VDD1) ; port VCCA
5P0_B: C80.1 C81.1 U7.10(EN2) U7.16(VDD2) U8.4(G) U8.16(VCC) ; port VCCB
GND: C79.2 R108.1 R109.1 R110.1 U7.2(GND1) U7.8(GND1) ; port GNDA
GND_B: C80.2 C81.2 U7.9(GND2) U7.15(GND2) U8.8(GND) U8.12(~{G}) ; port GNDB
MCU_A: R109.2 U7.4(A2) ; port A
MCU_B: R108.2 U7.5(A3) ; port B
MCU_I: R110.2 U7.6(A4) ; port I
MCU_UART_TX: R107.2 U7.3(A1) ; port UART_TX
WS22_A._N: U8.5(~{OUT2}) ; port WS22_A._N
WS22_A._P: U8.6(OUT2) ; port WS22_A._P
WS22_B._N: U8.11(~{OUT3}) ; port WS22_B._N
WS22_B._P: U8.10(OUT3) ; port WS22_B._P
WS22_I._N: U8.13(~{OUT4}) ; port WS22_I._N
WS22_I._P: U8.14(OUT4) ; port WS22_I._P
WS22_UART._N: U8.3(~{OUT1}) ; port WS22_UART._N
WS22_UART._P: U8.2(OUT1) ; port WS22_UART._P
NetU7_11: U7.11(B4) U8.15(IN4)
NetU7_12: U7.12(B3) U8.9(IN3)
NetU7_13: U7.13(B2) U8.7(IN2)
NetU7_14: U7.14(B1) U8.1(IN1)

Not connected (* = marked no-connect by the designer): U7 7(NC)

### Notes on the sheet
- LV domain
- HV domain
- Isolated differential drive to Wavesculptor
- (in symbol CGA2B3X7R1H104M050BB) A

### Library data of the parts
C79-C81 = CGA2B3X7R1H104M050BB: as C48 on sheet eth_lan8742a_phy; ComponentLink1URL: https://product.tdk.com/info/en/catalog/datasheets/mlcc_automotive_general_en.pdf?ref_disty=digikey; ComponentLink1Description: Series Datasheet; Series: CGA; Part Status: Active; Temperature Coefficient: X7R; Operating Temperature: -55°C ~ 125°C; Applications: AEC-Q200; Mounting Type: Surface Mount, MLCC; Package / Case: 0402 (1005 Metric); Size / Dimension: 0.039" L x 0.020" W (1.00mm x 0.50mm); Thickness (Max): 0.022" (0.55mm); Supplier 1: Digikey; Supplier Part Number 1: 445-12271-1-ND; Manufacturer Part Number: CGA2B3X7R1H104M050BB
R107-R110 = ERJ-2RKF1002X: as R67 on sheet eth_lan8742a_phy; ComponentLink1Description: Datasheet; ComponentLink1URL: https://industrial.panasonic.com/cdbs/www-data/pdf/RDA0000/AOA0000C304.pdf; Series: ERJ; Tolerance: ±1%; Composition: Thick Film; Features: Automotive AEC-Q200; Operating Temperature: -55°C ~ 155°C; Package / Case: 0402 (1005 Metric); Supplier Device Package: 0402; Size / Dimension: 0.039" L x 0.020" W (1.00mm x 0.50mm); Height - Seated (Max): 0.016" (0.40mm); Supplier 1: Digikey; Supplier Part Number 1: P10.0KLCT-ND; Manufacturer Part Number: ERJ-2RKF1002X
U7 = ISO_SI8040AA-B-IU: 4 ch 1 kV digital isolator; Manufacturer: Skyworks Solutions; Supplier 1: Digikey; Supplier Part Number 1: 336-5446-ND; Manufacturer Part Number: SI8040AA-B-IU; Supplier 2: LCSC; Supplier Part Number 2: C6296431; ComponentLink1Description: Datasheet; ComponentLink1URL: https://www.skyworksinc.com/-/media/Skyworks/SL/documents/public/data-sheets/Si80xx-1kV.pdf
U8 = RS422_AM26C31QDR: IC QUAD DIFF LINE DRIVER 16-SOIC; Manufacturer: Texas Instruments; Supplier 1: Digikey; ComponentLink1URL: https://www.ti.com/lit/ds/symlink/am26c31.pdf; ComponentLink1Description: Datasheet; Supplier Part Number 1: 296-41199-1-ND; Manufacturer Part Number: AM26C31MDREP; Supplier 2: LCSC; Supplier Part Number 2: C337769

## Sheet resolver_ad2s1210.SchDoc
size B; SheetNumber: 13
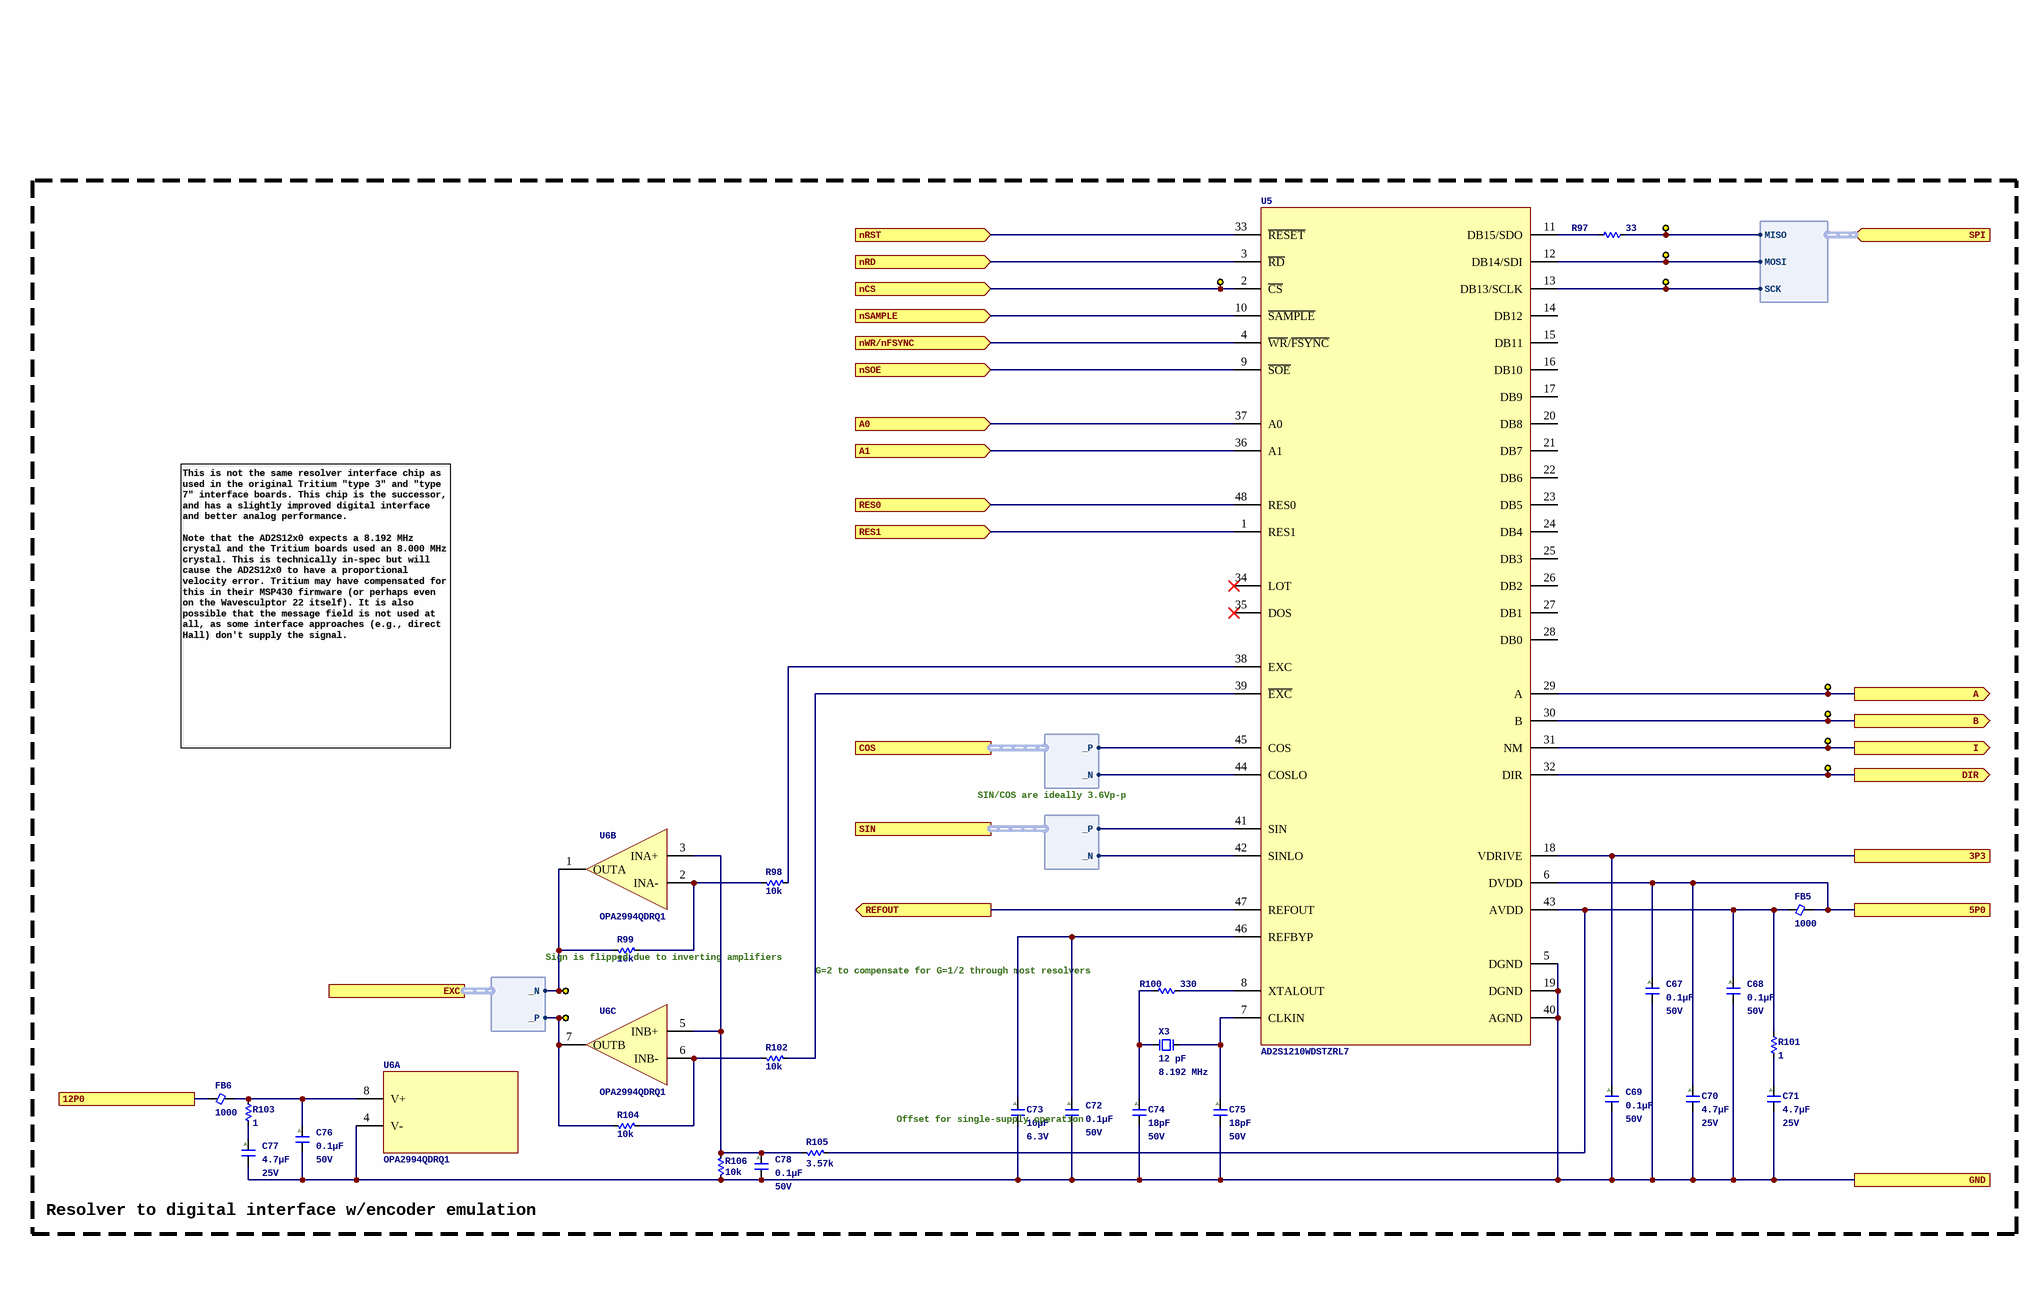
[diagram p16: resolver_ad2s1210.SchDoc]

### Parts
C67  Capacitance: 0.1µF  Voltage - Rated: 50V  [C0402_0.55MM]  (hidden comment: CGA2B3X7R1H104M050BB)
C68  Capacitance: 0.1µF  Voltage - Rated: 50V  [C0402_0.55MM]  (hidden comment: CGA2B3X7R1H104M050BB)
C69  Capacitance: 0.1µF  Voltage - Rated: 50V  [C0402_0.55MM]  (hidden comment: CGA2B3X7R1H104M050BB)
C70  Capacitance: 4.7µF  Voltage - Rated: 25V  [C0805_1.45MM]  (hidden comment: CGA4J1X7R1E475K125AC)
C71  Capacitance: 4.7µF  Voltage - Rated: 25V  [C0805_1.45MM]  (hidden comment: CGA4J1X7R1E475K125AC)
C72  Capacitance: 0.1µF  Voltage - Rated: 50V  [C0402_0.55MM]  (hidden comment: CGA2B3X7R1H104M050BB)
C73  Capacitance: 10µF  Voltage - Rated: 6.3V  [C0805_1.45MM]  (hidden comment: CGA4J1X7R0J106M125AC)
C74  Capacitance: 18pF  Voltage - Rated: 50V  [C0402_0.55MM]  (hidden comment: CGA2B2C0G1H180J050BA)
C75  Capacitance: 18pF  Voltage - Rated: 50V  [C0402_0.55MM]  (hidden comment: CGA2B2C0G1H180J050BA)
C76  Capacitance: 0.1µF  Voltage - Rated: 50V  [C0402_0.55MM]  (hidden comment: CGA2B3X7R1H104M050BB)
C77  Capacitance: 4.7µF  Voltage - Rated: 25V  [C0805_1.45MM]  (hidden comment: CGA4J1X7R1E475K125AC)
C78  Capacitance: 0.1µF  Voltage - Rated: 50V  [C0402_0.55MM]  (hidden comment: CGA2B3X7R1H104M050BB)
FB5  Impedance (Ohms @ 100MHz): 1000  [FB0805_1.05MM]  (hidden comment: MPZ2012S102AT000)
FB6  Impedance (Ohms @ 100MHz): 1000  [FB0805_1.05MM]  (hidden comment: MPZ2012S102AT000)
R97  Resistance: 33  [R0402_0.40MM]  (hidden comment: ERJ-2RKF33R0X)
R98  Resistance: 10k  [R0402_0.40MM]  (hidden comment: ERJ-2RKF1002X)
R99  Resistance: 10k  [R0402_0.40MM]  (hidden comment: ERJ-2RKF1002X)
R100  Resistance: 330  [R0402_0.40MM]  (hidden comment: ERJ-PA2F3300X)
R101  Resistance: 1  [R0402_0.40MM]  (hidden comment: ERJ-2BQF1R0X)
R102  Resistance: 10k  [R0402_0.40MM]  (hidden comment: ERJ-2RKF1002X)
R103  Resistance: 1  [R0402_0.40MM]  (hidden comment: ERJ-2BQF1R0X)
R104  Resistance: 10k  [R0402_0.40MM]  (hidden comment: ERJ-2RKF1002X)
R105  Resistance: 3.57k  [R0402_0.40MM]  (hidden comment: ERJ-2RKF3571X)
R106  Resistance: 10k  [R0402_0.40MM]  (hidden comment: ERJ-2RKF1002X)
TP5  (no value)  [TP_GRABBY]  (no BOM)
TP6  (no value)  [TP_GRABBY]  (no BOM)
TP7  (no value)  [TP_GRABBY]  (no BOM)
TP18  (no value)  [TP_GRABBY]  (no BOM)
TP19  (no value)  [TP_GRABBY]  (no BOM)
TP20  (no value)  [TP_GRABBY]  (no BOM)
TP21  (no value)  [TP_GRABBY]  (no BOM)
TP22  (no value)  [TP_GRABBY]  (no BOM)
TP23  RH-5002  [TP_RH-5002]  (value not drawn)
TP24  RH-5002  [TP_RH-5002]  (value not drawn)
U5  AD2S1210WDSTZRL7  [48TQFP7]
U6  OPA2994QDRQ1  [8SOIC150]  (parts A,B,C of 3)
X3  Load Capacitance: 12 pF  Frequency: 8.192 MHz  [XTAL_ECX-53Q]  (hidden comment: ECS-81.92-12-30Q-EN-TR)

### Ports
3P3, 5P0, 12P0, A0 (in), A1 (in), A (out), B (out), COS (harness DIFF), DIR (out), EXC (harness DIFF), GND, I (out), nCS (in), nRD (in), nRST (in), nSAMPLE (in), nSOE (in), nWR/nFSYNC (in), REFOUT (out), RES0 (in), RES1 (in), SIN (harness DIFF), SPI (in, harness SPI)

### Harnesses
DIFF: _P, _N
SPI: MISO, MOSI, SCK

### Nets
3P3: C69.1 U5.18(VDRIVE) ; port 3P3
5P0: C67.1 C70.1 FB5.2 U5.6(DVDD) ; port 5P0
GND: C67.2 C68.2 C69.2 C70.2 C71.2 C72.2 C73.2 C74.2 C75.2 C76.2 C77.2 C78.2 R106.2 U5.5(DGND) U5.19(DGND) U5.40(AGND) U6.4(V-) ; port GND
LV: FB6.1 ; port 12P0
CONN_RES_COS._N: U5.44(COSLO) ; port COS._N
CONN_RES_COS._P: U5.45(COS) ; port COS._P
CONN_RES_EXC._N: R99.1 TP23.1 U6.1(OUTA) ; port EXC._N
CONN_RES_EXC._P: R104.1 TP24.1 U6.7(OUTB) ; port EXC._P
CONN_RES_REFOUT: U5.47(REFOUT) ; port REFOUT
CONN_RES_SIN._N: U5.42(SINLO) ; port SIN._N
CONN_RES_SIN._P: U5.41(SIN) ; port SIN._P
RES_A: TP18.1 U5.29(A) ; port A
RES_A0: U5.37(A0) ; port A0
RES_A1: U5.36(A1) ; port A1
RES_B: TP19.1 U5.30(B) ; port B
RES_DIR: TP21.1 U5.32(DIR) ; port DIR
RES_I: TP20.1 U5.31(NM) ; port I
RES_nCS: TP22.1 U5.2(~{CS}) ; port nCS
RES_nRD: U5.3(~{RD}) ; port nRD
RES_nRST: U5.33(~{RESET}) ; port nRST
RES_nSAMPLE: U5.10(~{SAMPLE}) ; port nSAMPLE
RES_nSOE: U5.9(~{SOE}) ; port nSOE
RES_nWR: U5.4(~{WR}/~{FSYNC}) ; port nWR/nFSYNC
RES_RES0: U5.48(RES0) ; port RES0
RES_RES1: U5.1(RES1) ; port RES1
SPI4.MISO: R97.1 TP5.1 ; port SPI.MISO
SPI4.MOSI: TP6.1 U5.12(DB14/SDI) ; port SPI.MOSI
SPI4.SCK: TP7.1 U5.13(DB13/SCLK) ; port SPI.SCK
NetC68_1: C68.1 FB5.1 R101.2 R105.2 U5.43(AVDD)
NetC71_1: C71.1 R101.1
NetC72_1: C72.1 C73.1 U5.46(REFBYP)
NetC74_1: C74.1 R100.1 X3.1
NetC75_1: C75.1 U5.7(CLKIN) X3.2
NetC76_1: C76.1 FB6.2 R103.2 U6.8(V+)
NetC77_1: C77.1 R103.1
NetC78_1: C78.1 R105.1 R106.1 U6.3(INA+) U6.5(INB+)
NetR97_2: R97.2 U5.11(DB15/SDO)
NetR98_1: R98.1 R99.2 U6.2(INA-)
NetR98_2: R98.2 U5.38(EXC)
NetR100_2: R100.2 U5.8(XTALOUT)
NetR102_1: R102.1 R104.2 U6.6(INB-)
NetR102_2: R102.2 U5.39(~{EXC})

Not connected (* = marked no-connect by the designer): U5 14(DB12) 15(DB11) 16(DB10) 17(DB9) 20(DB8) 21(DB7) 22(DB6) 23(DB5) 24(DB4) 25(DB3) 26(DB2) 27(DB1) 28(DB0) 34(LOT)* 35(DOS)*

### Notes on the sheet
- This is not the same resolver interface chip as used in the original Tritium "type 3" and "type 7" interface boards. This chip is the successor, and has a slightly improved digital interface and better analog performance.
  Note that the AD2S12x0 expects a 8.192 MHz crystal and the Tritium boards used an 8.000 MHz crystal. This is technically in-spec but will cause the AD2S12x0 to have a proportional velocity error. Tritium may have compensated for this in their MSP430 firmware (or perhaps even on the Wavesculptor 22 itself). It is also possible that the message field is not used at all, as some interface approaches (e.g., direct Hall) don't supply the signal.
- SIN/COS are ideally 3.6Vp-p
- (near TP23) Sign is flipped due to inverting amplifiers
- G=2 to compensate for G=1/2 through most resolvers
- Offset for single-supply operation
- Resolver to digital interface w/encoder emulation
- (in symbol CGA2B2C0G1H180J050BA) A
- (in symbol CGA2B3X7R1H104M050BB) A
- (in symbol CGA4J1X7R0J106M125AC) A
- (in symbol CGA4J1X7R1E475K125AC) A

### Library data of the parts
C67-C69 C72 C76 C78 = CGA2B3X7R1H104M050BB: as C48 on sheet eth_lan8742a_phy; ComponentLink1URL: https://product.tdk.com/info/en/catalog/datasheets/mlcc_automotive_general_en.pdf?ref_disty=digikey; ComponentLink1Description: Series Datasheet; Series: CGA; Part Status: Active; Temperature Coefficient: X7R; Operating Temperature: -55°C ~ 125°C; Applications: AEC-Q200; Mounting Type: Surface Mount, MLCC; Package / Case: 0402 (1005 Metric); Size / Dimension: 0.039" L x 0.020" W (1.00mm x 0.50mm); Thickness (Max): 0.022" (0.55mm); Supplier 1: Digikey; Supplier Part Number 1: 445-12271-1-ND; Manufacturer Part Number: CGA2B3X7R1H104M050BB
C70 C71 C77 = CGA4J1X7R1E475K125AC: CAP CER 4.7UF 25V X7R 0805; Manufacturer: TDK Corporation; Unit Price (USD): 0.56; Tolerance: ±10%; ComponentLink1URL: https://product.tdk.com/info/en/catalog/datasheets/mlcc_automotive_general_en.pdf?ref_disty=digikey; ComponentLink1Description: Series Datasheet; Series: CGA; Part Status: Active; Temperature Coefficient: X7R; Operating Temperature: -55°C ~ 125°C; Applications: AEC-Q200; Mounting Type: Surface Mount, MLCC; Package / Case: 0805 (2012 Metric); Size / Dimension: 0.079" L x 0.049" W (2.00mm x 1.25mm); Thickness (Max): 0.057" (1.45mm); Supplier 1: Digikey; Supplier Part Number 1: 445-6967-1-ND; Manufacturer Part Number: CGA4J1X7R1E475K125AC
C73 = CGA4J1X7R0J106M125AC: as C50 on sheet eth_lan8742a_phy; ComponentLink1URL: https://product.tdk.com/info/en/catalog/datasheets/mlcc_automotive_general_en.pdf?ref_disty=digikey; ComponentLink1Description: Series Datasheet; Series: CGA; Part Status: Active; Temperature Coefficient: X7R; Operating Temperature: -55°C ~ 125°C; Applications: AEC-Q200; Mounting Type: Surface Mount, MLCC; Package / Case: 0805 (2012 Metric); Size / Dimension: 0.079" L x 0.049" W (2.00mm x 1.25mm); Thickness (Max): 0.057" (1.45mm); Supplier 1: Digikey; Supplier Part Number 1: 445-12776-1-ND; Manufacturer Part Number: CGA4J1X7R0J106M125AC
C74 C75 = CGA2B2C0G1H180J050BA: CAP CER 18PF 50V C0G 0402; Manufacturer: TDK Corporation; Unit Price (USD): 0.1; Tolerance: ±5%; Temperature Coefficient: C0G, NP0; ComponentLink1URL: https://product.tdk.com/info/en/catalog/datasheets/mlcc_automotive_general_en.pdf?ref_disty=digikey; ComponentLink1Description: Series Datasheet; Supplier 1: Digikey; Supplier Part Number 1: 445-5587-1-ND; Series: CGA; Part Status: Active; Operating Temperature: -55°C ~ 125°C; Applications: AEC-Q200; Mounting Type: Surface Mount, MLCC; Package / Case: 0402 (1005 Metric); Size / Dimension: 0.039" L x 0.020" W (1.00mm x 0.50mm); Thickness (Max): 0.022" (0.55mm); Manufacturer Part Number: CGA2B2C0G1H180J050BA
FB5 FB6 = MPZ2012S102AT000: FERRITE BEAD 1 KOHM 0805 1LN; Manufacturer: TDK Corporation; Filter Type: Power Line; Current Rating (Max): 1.5A; DC Resistance (DCR) (Max): 150mOhm; ComponentLink1URL: https://product.tdk.com/info/en/catalog/datasheets/beads_commercial_power_mpz2012_en.pdf?ref_disty=digikey; ComponentLink1Description: Datasheet; Series: MPZ; Part Status: Active; Operating Temperature: -55°C ~ 125°C; Package / Case: 0805 (2012 Metric); Mounting Type: Surface Mount; Height (Max): 0.041" (1.05mm); Size / Dimension: 0.079" L x 0.049" W (2.00mm x 1.25mm); Supplier Part Number 1: 445-5223-1-ND; Supplier 1: Digikey; Manufacturer Part Number: MPZ2012S102AT000
R97 = ERJ-2RKF33R0X: as R65 on sheet eth_lan8742a_phy; ComponentLink1Description: Datasheet; ComponentLink1URL: https://industrial.panasonic.com/cdbs/www-data/pdf/RDA0000/AOA0000C304.pdf; Series: ERJ; Tolerance: ±1%; Composition: Thick Film; Features: Automotive AEC-Q200; Operating Temperature: -55°C ~ 155°C; Package / Case: 0402 (1005 Metric); Supplier Device Package: 0402; Size / Dimension: 0.039" L x 0.020" W (1.00mm x 0.50mm); Height - Seated (Max): 0.016" (0.40mm); Supplier 1: Digikey; Supplier Part Number 1: P33.0LCT-ND; Manufacturer Part Number: ERJ-2RKF33R0X
R98 R99 R102 R104 R106 = ERJ-2RKF1002X: as R67 on sheet eth_lan8742a_phy; ComponentLink1Description: Datasheet; ComponentLink1URL: https://industrial.panasonic.com/cdbs/www-data/pdf/RDA0000/AOA0000C304.pdf; Series: ERJ; Tolerance: ±1%; Composition: Thick Film; Features: Automotive AEC-Q200; Operating Temperature: -55°C ~ 155°C; Package / Case: 0402 (1005 Metric); Supplier Device Package: 0402; Size / Dimension: 0.039" L x 0.020" W (1.00mm x 0.50mm); Height - Seated (Max): 0.016" (0.40mm); Supplier 1: Digikey; Supplier Part Number 1: P10.0KLCT-ND; Manufacturer Part Number: ERJ-2RKF1002X
R100 = ERJ-PA2F3300X: as R69 on sheet eth_lan8742a_phy; ComponentLink1Description: Datasheet; ComponentLink1URL: https://industrial.panasonic.com/cdbs/www-data/pdf/RDO0000/AOA0000C331.pdf; Series: ERJ; Tolerance: ±1%; Composition: Thick Film; Features: Automotive AEC-Q200, Pulse Withstanding; Operating Temperature: -55°C ~ 155°C; Package / Case: 0402 (1005 Metric); Supplier Device Package: 0402; Size / Dimension: 0.039" L x 0.020" W (1.00mm x 0.50mm); Height - Seated (Max): 0.016" (0.40mm); Supplier 1: Digikey; Supplier Part Number 1: P17221CT-ND; Manufacturer Part Number: ERJ-PA2F3300X
R101 R103 = ERJ-2BQF1R0X: as R68 on sheet eth_lan8742a_phy; ComponentLink1Description: Datasheet; ComponentLink1URL: https://industrial.panasonic.com/cdbs/www-data/pdf/RDN0000/AOA0000C313.pdf; Series: ERJ; Tolerance: ±1%; Composition: Thick Film; Features: Automotive AEC-Q200, Current Sense; Operating Temperature: -55°C ~ 125°C; Package / Case: 0402 (1005 Metric); Supplier Device Package: 0402; Size / Dimension: 0.039" L x 0.020" W (1.00mm x 0.50mm); Height - Seated (Max): 0.016" (0.40mm); Supplier 1: Digikey; Supplier Part Number 1: P17252CT-ND; Manufacturer Part Number: ERJ-2BQF1R0X
R105 = ERJ-2RKF3571X: RES SMD 3.57K OHM 1% 1/10W 0402; Manufacturer: Panasonic Electronic Components; Unit Price (USD): 0.1; Power (Watts): 0.1W, 1/10W; Temperature Coefficient: ±100ppm/°C; ComponentLink1Description: Datasheet; ComponentLink1URL: https://industrial.panasonic.com/cdbs/www-data/pdf/RDA0000/AOA0000C304.pdf; Series: ERJ; Tolerance: ±1%; Composition: Thick Film; Features: Automotive AEC-Q200; Operating Temperature: -55°C ~ 155°C; Package / Case: 0402 (1005 Metric); Supplier Device Package: 0402; Size / Dimension: 0.039" L x 0.020" W (1.00mm x 0.50mm); Height - Seated (Max): 0.016" (0.40mm); Supplier 1: Digikey; Supplier Part Number 1: P3.57KLCT-ND; Manufacturer Part Number: ERJ-2RKF3571X
TP5-TP7 TP18-TP22 = TEST_GRABBER: EMBEDDED TEST POINT FOR SALEAE TEST CLIPS
TP23 TP24 = RH-5002: THT white clip turret; Manufacturer: ronghe; ComponentLink1Description: Datasheet; ComponentLink1URL: https://datasheet.lcsc.com/lcsc/2307040929_ronghe-RH-5000_C5277086.pdf; Supplier 1: LCSC; Supplier Part Number 1: C5199802; Manufacturer Part Number: RH-5002
U5 = RESOLVER_AD2S1210WDSTZ: Synchro or Resolver to Digital Converter, PQFP44; Manufacturer: Analog Devices; Supplier 1: Digikey; Supplier Part Number 1: 505-AD2S1210WDSTZRL7CT-ND; Manufacturer Part Number: AD2S1210WDSTZRL7; ComponentLink1Description: Datasheet; ComponentLink1URL: https://www.analog.com/media/en/technical-documentation/data-sheets/AD2S1210.pdf; Supplier 2: LCSC; Supplier Part Number 2: C459871
U6 = OPAMP_OPA2994QDRQ1: Automotive, dual, 24V 25MHz high-output-current (150 mA) operational amplifier 8-SOIC -40 to 125; Manufacturer: Texas Instruments; Supplier 1: Digikey; Supplier Part Number 1: 296-OPA2994QDRQ1CT-ND; Manufacturer Part Number: OPA2994QDRQ1; Supplier 2: LCSC; Supplier Part Number 2: C4369938; ComponentLink1Description: Datasheet; ComponentLink1URL: https://www.ti.com/lit/ds/symlink/opa2994-q1.pdf
X3 = XTAL_ECS-81.92-12-30Q-EN-TR: Parallel - Fundamental Quartz Crystal, 8.192MHz Nom; Manufacturer: ECS International; Supplier 1: Digikey; Supplier Part Number 1: XC3145CT-ND; Manufacturer Part Number: ECS-81.92-12-30Q-EN-TR; Supplier 2: LCSC; Supplier Part Number 2: C2450755; ComponentLink1Description: Datasheet; ComponentLink1URL: https://ecsxtal.com/store/pdf/ECX-53Q.pdf